# Altium schematic sheet Sheet1.SchDoc
size C; SheetNumber: 1; SheetTotal: 1
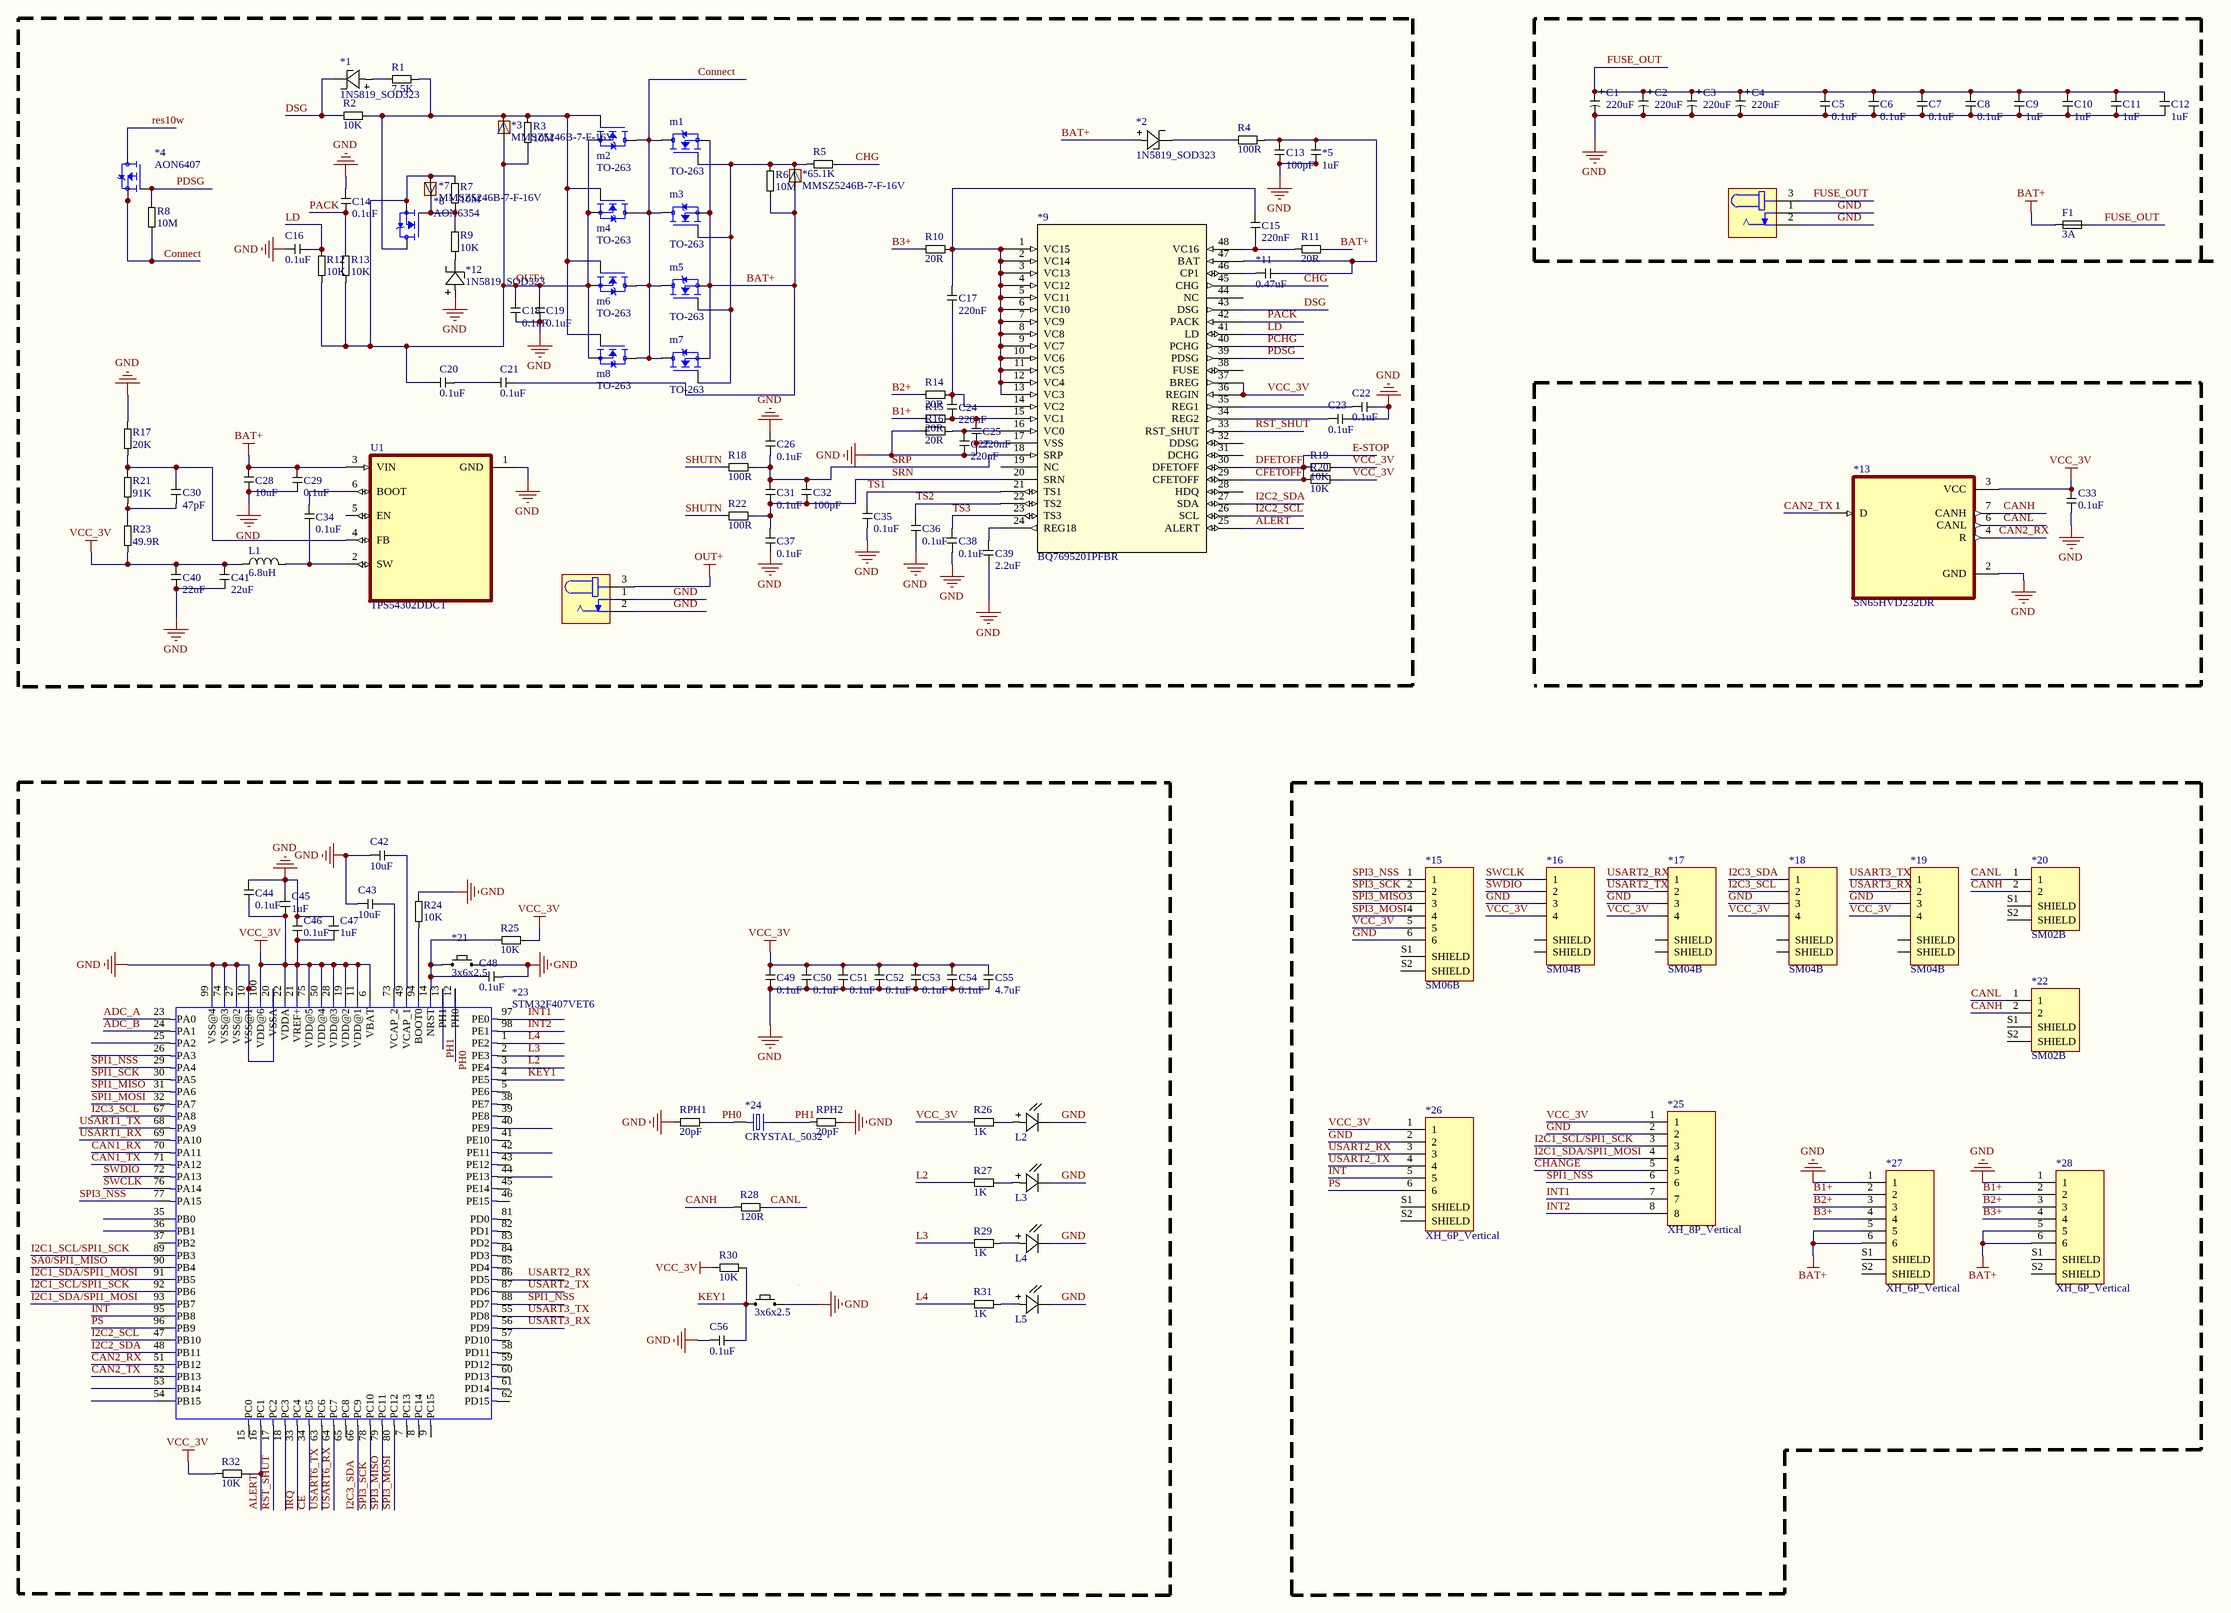
[diagram p0: Sheet1.SchDoc]

## Parts
*1  1N5819_SOD323  [1N5819_SOD323]
*2  1N5819_SOD323  [1N5819_SOD323]
*3  MMSZ5246B-7-F-16V  [MMSZ5246B-7-F-16V]
*4  AON6407  [AON6407]
*5  1uF  [CAP_1210]
*6  MMSZ5246B-7-F-16V  [MMSZ5246B-7-F-16V]
*7  MMSZ5246B-7-F-16V  [MMSZ5246B-7-F-16V]
*8  AON6354  [AON6354]
*9  BQ7695201PFBR  [BQ7695201PFBR]
*10  DC005  [DC005]  (value not drawn)
*11  0.47uF  [CAP_1210]
*12  1N5819_SOD323  [1N5819_SOD323]
*13  SN65HVD232DR  [SN65HVD232DR]
*14  DC005  [DC005]  (value not drawn)
*15  SM06B  [SM06B]
*16  SM04B  [SM04B]
*17  SM04B  [SM04B]
*18  SM04B  [SM04B]
*19  SM04B  [SM04B]
*20  SM02B  [SMB02]
*21  3x6x2.5  [3x6x2.5]
*22  SM02B  [SMB02]
*23  STM32F407VET6  [STM32F407VET6]
*24  CRYSTAL_5032  [CRYSTAL_5032]
*25  XH_8P_Vertical  [XH_8P_Vertical]
*26  XH_6P_Vertical  [XH_6P_Vertical]
*27  XH_6P_Vertical  [XH_6P_Vertical]
*28  XH_6P_Vertical  [XH_6P_Vertical]
*29  3x6x2.5  [3x6x2.5]
C1  220uF  [E-CAP_8x10]
C2  220uF  [E-CAP_8x10]
C3  220uF  [E-CAP_8x10]
C4  220uF  [E-CAP_8x10]
C5  0.1uF  [CAP_0603]
C6  0.1uF  [CAP_0603]
C7  0.1uF  [CAP_0603]
C8  0.1uF  [CAP_0603]
C9  1uF  [CAP_0603]
C10  1uF  [CAP_0603]
C11  1uF  [CAP_0603]
C12  1uF  [CAP_0603]
C13  100pF  [CAP_1206]
C14  0.1uF  [CAP_0402]
C15  220nF  [CAP_0603]
C16  0.1uF  [CAP_0402]
C17  220nF  [CAP_0603]
C18  0.1uF  [CAP_1206]
C19  0.1uF  [CAP_1206]
C20  0.1uF  [CAP_1206]
C21  0.1uF  [CAP_1206]
C22  0.1uF  [CAP_0402]
C23  0.1uF  [CAP_0402]
C24  220nF  [CAP_0603]
C25  220nF  [CAP_0603]
C26  0.1uF  [CAP_0402]
C27  220nF  [CAP_0603]
C28  10uF  [CAP_0805]
C29  0.1uF  [CAP_0603]
C30  47pF  [CAP_0402]
C31  0.1uF  [CAP_0402]
C32  100pF  [CAP_0402]
C33  0.1uF  [CAP_0402]
C34  0.1uF  [CAP_0402]
C35  0.1uF  [CAP_0402]
C36  0.1uF  [CAP_0402]
C37  0.1uF  [CAP_0402]
C38  0.1uF  [CAP_0402]
C39  2.2uF  [CAP_0402]
C40  22uF  [CAP_1206]
C41  22uF  [CAP_1206]
C42  10uF  [CAP_0402]
C43  10uF  [CAP_0402]
C44  0.1uF  [CAP_0402]
C45  1uF  [CAP_0402]
C46  0.1uF  [CAP_0402]
C47  1uF  [CAP_0402]
C48  0.1uF  [CAP_0402]
C49  0.1uF  [CAP_0402]
C50  0.1uF  [CAP_0402]
C51  0.1uF  [CAP_0402]
C52  0.1uF  [CAP_0402]
C53  0.1uF  [CAP_0402]
C54  0.1uF  [CAP_0402]
C55  4.7uF  [CAP_0402]
C56  0.1uF  [CAP_0402]
F1  3A  [FUSE_HOLDER_1808/2410]
L1  6.8uH  [IND_0420]
L2  LED_0603  [LED_0603]  (value not drawn)
L3  LED_0603  [LED_0603]  (value not drawn)
L4  LED_0603  [LED_0603]  (value not drawn)
L5  LED_0603  [LED_0603]  (value not drawn)
m1  TO-263  [TO-263]
m2  TO-263  [TO-263]
m3  TO-263  [TO-263]
m4  TO-263  [TO-263]
m5  TO-263  [TO-263]
m6  TO-263  [TO-263]
m7  TO-263  [TO-263]
m8  TO-263  [TO-263]
R1  7.5K  [RES_0402]
R2  10K  [RES_0402]
R3  10M  [RES_0402]
R4  100R  [res_1206]
R5  5.1K  [RES_0402]
R6  10M  [RES_0402]
R7  10M  [RES_0402]
R8  10M  [RES_0402]
R9  10K  [RES_0402]
R10  20R  [RES_0603]
R11  20R  [RES_0603]
R12  10K  [RES_0402]
R13  10K  [RES_0402]
R14  20R  [RES_0603]
R15  20R  [RES_0603]
R16  20R  [RES_0603]
R17  20K  [RES_0402]
R18  100R  [RES_0402]
R19  10K  [RES_0402]
R20  10K  [RES_0402]
R21  91K  [RES_0402]
R22  100R  [RES_0402]
R23  49.9R  [RES_0603]
R24  10K  [RES_0402]
R25  10K  [RES_0402]
R26  1K  [RES_0402]
R27  1K  [RES_0402]
R28  120R  [RES_0402]
R29  1K  [RES_0402]
R30  10K  [RES_0402]
R31  1K  [RES_0402]
R32  10K  [RES_0402]
RPH1  20pF  [RES_0402]
RPH2  20pF  [RES_0402]
U1  TPS54302DDCT  [SOT95P280X110-6N]

## Nets
BAT+: *2.2 *6.2(A) *27.5 *27.6 *28.5 *28.6 C21.2 C28.1 C29.2 F1.1 m1.S m3.S m5.S m7.S R6.1 R11.2 U1.3(VIN)
GND: *5.1 *9.17(VSS) *10.1 *10.2 *12.2 *13.2(GND) *14.1 *14.2 *15.6 *16.3 *17.3 *18.3 *19.3 *21.2 *23.10(VSS@1) *23.20(VSSA) *23.27(VSS@2) *23.74(VSS@3) *23.99(VSS@4) *25.2 *26.2 *27.1 *28.1 *29.2 C1.2 C2.2 C3.2 C4.2 C5.1 C6.1 C7.1 C8.1 C9.1 C10.1 C11.1 C12.1 C13.1 C14.2 C16.1 C18.1 C19.1 C22.2 C23.2 C25.1 C26.2 C27.1 C28.2 C29.1 C33.2 C35.1 C36.1 C37.1 C38.1 C39.1 C40.1 C41.1 C42.1 C43.1 C44.2 C45.1 C46.1 C47.1 C48.2 C49.1 C50.1 C51.1 C52.1 C53.1 C54.1 C55.1 C56.1 L2.1 L3.1 L4.1 L5.1 R16.1 R17.2 R24.1 RPH1.2 RPH2.1 U1.1(GND)
OUT+: *3.2(A) *7.2(A) *8.3 *14.3 C18.2 C19.2 C20.1 m2.S m4.S m6.S m8.S R3.1 R7.2 R12.2 R13.2
VCC_3V: *9.36(REGIN) *9.37(BREG) *13.3(VCC) *15.5 *16.4 *17.4 *18.4 *19.4 *23.6(VBAT) *23.11(VDD@1) *23.19(VDD@2) *23.21(VREF+) *23.22(VDDA) *23.28(VDD@3) *23.50(VDD@4) *23.75(VDD@5) *23.100(VDD@6) *25.1 *26.1 C33.1 C40.2 C41.2 C44.1 C45.2 C46.2 C47.2 C49.2 C50.2 C51.2 C52.2 C53.2 C54.2 C55.2 L1.1 R19.2 R20.2 R23.2 R25.2 R26.1 R30.1 R32.2
ADC_A: *23.23(PA0)
ADC_B: *23.24(PA1)
ALERT: *9.25(ALERT) *23.16(PC1) R32.1
B1+: *27.2 *28.2 R15.1
B2+: *27.3 *28.3 R14.1
B3+: *27.4 *28.4 R10.1
CAN1_RX: *23.70(PA11)
CAN1_TX: *23.71(PA12)
CAN2_RX: *13.4(R) *23.51(PB12)
CAN2_TX: *13.1(D) *23.52(PB13)
CANH: *13.7(CANH) *20.2 *22.2 R28.2
CANL: *13.6(CANL) *20.1 *22.1 R28.1
CE: *23.34(PC5)
CFETOFF: *9.29(CFETOFF) *9.30(DFETOFF) R19.1 R20.1  [also labelled DFETOFF, E-STOP]
CHANGE: *25.5
CHG: *9.45(CHG) R5.1
Connect: *4.1(S) *4.2(S) *4.3(S) m1.D m2.D m3.D m4.D m5.D m6.D m7.D m8.D R8.1
DSG: *1.1 *9.43(DSG) R2.2
FUSE_OUT: *10.3 C1.1 C2.1 C3.1 C4.1 C5.2 C6.2 C7.2 C8.2 C9.2 C10.2 C11.2 C12.2 F1.2
I2C1_SCL/SPI1_SCK: *23.89(PB3) *23.92(PB6) *25.3
I2C1_SDA/SPI1_MOSI: *23.91(PB5) *23.93(PB7) *25.4
I2C2_SCL: *9.26(SCL) *23.47(PB10)
I2C2_SDA: *9.27(SDA) *23.48(PB11)
I2C3_SCL: *18.2 *23.67(PA8)
I2C3_SDA: *18.1 *23.66(PC9)
INT: *23.95(PB8) *26.5
INT1: *23.97(PE0) *25.7
INT2: *23.98(PE1) *25.8
IRQ: *23.33(PC4)
KEY1: *23.4(PE5) *29.1 C56.2 R30.2
L2: *23.3(PE4) R27.2
L3: *23.2(PE3) R29.1
L4: *23.1(PE2) R31.1
LD: *9.41(LD) C16.2 R12.1
PACK: *9.42(PACK) C14.1 R13.1
PCHG: *9.40(PCHG)
PDSG: *4.4(G) *9.39(PDSG) R8.2
PH0: *23.12(PH0) *24.1 RPH1.1
PH1: *23.13(PH1) *24.2 RPH2.2
PS: *23.96(PB9) *26.6
res10w: *4.5_8(D)
RST_SHUT: *9.33(RST_SHUT) *23.17(PC2)
SA0/SPI1_MISO: *23.90(PB4)
SHUTN: R18.1 R22.1
SPI1_MISO: *23.31(PA6)
SPI1_MOSI: *23.32(PA7)
SPI1_NSS: *23.29(PA4) *23.88(PD7) *25.6
SPI1_SCK: *23.30(PA5)
SPI3_MISO: *15.3 *23.79(PC11)
SPI3_MOSI: *15.4 *23.80(PC12)
SPI3_NSS: *15.1 *23.77(PA15)
SPI3_SCK: *15.2 *23.78(PC10)
SRN: *9.20(SRN) C31.1 C32.1 C37.2 R22.2
SRP: *9.18(SRP) C26.1 C31.2 C32.2 R18.2
SWCLK: *16.1 *23.76(PA14)
SWDIO: *16.2 *23.72(PA13)
TS1: *9.21(TS1) C35.2
TS2: *9.22(TS2) C36.2
TS3: *9.23(TS3) C38.2
USART1_RX: *23.69(PA10)
USART1_TX: *23.68(PA9)
USART2_RX: *17.1 *23.86(PD5) *26.3
USART2_TX: *17.2 *23.87(PD6) *26.4
USART3_RX: *19.2 *23.56(PD9)
USART3_TX: *19.1 *23.55(PD8)
USART6_RX: *23.64(PC7)
USART6_TX: *23.63(PC6)
Net*1_2: *1.2 R1.2
Net*2_1: *2.1 R4.1
Net*3_1: *3.1(C) *8.2 m2.G m4.G m6.G m8.G R1.1 R2.1 R3.2
Net*5_2: *5.2 *9.47(BAT) *11.2 C13.2 R4.2
Net*6_1: *6.1(C) m1.G m3.G m5.G m7.G R5.2 R6.2
Net*7_1: *7.1(C) *8.1 R7.1 R9.2
Net*9_1: *9.1(VC15) *9.2(VC14) *9.3(VC13) *9.4(VC12) *9.5(VC11) *9.6(VC10) *9.7(VC9) *9.8(VC8) *9.9(VC7) *9.10(VC6) *9.11(VC5) *9.12(VC4) *9.13(VC3) C15.2 C17.2 R10.2
Net*9_14: *9.14(VC2) C17.1 C24.2 R14.2
Net*9_15: *9.15(VC1) C24.1 C25.2 R15.2
Net*9_16: *9.16(VC0) C27.2 R16.2
Net*9_24: *9.24(REG18) C39.2
Net*9_34: *9.34(REG2) C23.1
Net*9_35: *9.35(REG1) C22.1
Net*9_46: *9.46(CP1) *11.1
Net*9_48: *9.48(VC16) C15.1 R11.1
Net*12_1: *12.1 R9.1
Net*21_1: *21.1 *23.14(NRST) C48.1 R25.1
Net*23_49: *23.49(VCAP_1) C42.2
Net*23_73: *23.73(VCAP_2) C43.2
Net*23_94: *23.94(BOOT0) R24.2
NetC20_2: C20.2 C21.1
NetC30_1: C30.1 R21.1 R23.1
NetC30_2: C30.2 R17.1 R21.2 U1.4(FB)
NetC34_1: C34.1 L1.2 U1.2(SW)
NetC34_2: C34.2 U1.6(BOOT)
NetL2_2: L2.2 R26.2
NetL3_2: L3.2 R27.1
NetL4_2: L4.2 R29.2
NetL5_2: L5.2 R31.2

Not connected (* = marked no-connect by the designer): *9 19(NC) 28(HDQ) 31(DCHG) 32(DDSG) 38(FUSE) 44(NC); *15 S1(SHIELD) S2(SHIELD); *16 S1(SHIELD) S2(SHIELD); *17 S1(SHIELD) S2(SHIELD); *18 S1(SHIELD) S2(SHIELD); *19 S1(SHIELD) S2(SHIELD); *20 S1(SHIELD) S2(SHIELD); *22 S1(SHIELD) S2(SHIELD); *23 5(PE6) 7(PC13) 8(PC14) 9(PC15) 15(PC0) 18(PC3) 25(PA2) 26(PA3) 35(PB0) 36(PB1) 37(PB2) 38(PE7) 39(PE8) 40(PE9) 41(PE10) 42(PE11) 43(PE12) 44(PE13) 45(PE14) 46(PE15) 53(PB14) 54(PB15) 57(PD10) 58(PD11) 59(PD12) 60(PD13) 61(PD14) 62(PD15) 65(PC8) 81(PD0) 82(PD1) 83(PD2) 84(PD3) 85(PD4); *26 S1(SHIELD) S2(SHIELD); *27 S1(SHIELD) S2(SHIELD); *28 S1(SHIELD) S2(SHIELD); U1 5(EN)

## Library data of the parts
*5 *11 = CAP_1210
C1-C4 = E-CAP_8x10
C5-C12 C15 C17 C24 C25 C27 C29 = CAP_0603
C13 C18-C21 C40 C41 = CAP_1206
C14 C16 C22 C23 C26 C30-C39 C42-C56 = CAP_0402
C28 = CAP_0805
F1 = FUSE_HOLDER_1808/2410
L1 = IND_0420
R1-R3 R5-R9 R12 R13 R17-R22 R24-R32 RPH1 RPH2 = RES_0402
R4 = RES_1206
R10 R11 R14-R16 R23 = RES_0603
U1 = TPS54302DDCT: 4.5-V to 28-V Input, 3-A Output, EMI Friendly Synchronous Step-Down Converter; MF: Texas Instruments; SnapEDA_Link: https://www.snapeda.com/parts/TPS54302DDCT/Texas+Instruments/view-part/?ref=snap; Package: SOT-23-THN-6 Texas Instruments; Value: *; MP: TPS54302DDCT; Check_prices: https://www.snapeda.com/parts/TPS54302DDCT/Texas+Instruments/view-part/?ref=eda